# EAGLE design watch_main_final (EAGLE 6.6.0)
MY_DRAWING_NAME: Numitron Geekwatch Processor Board
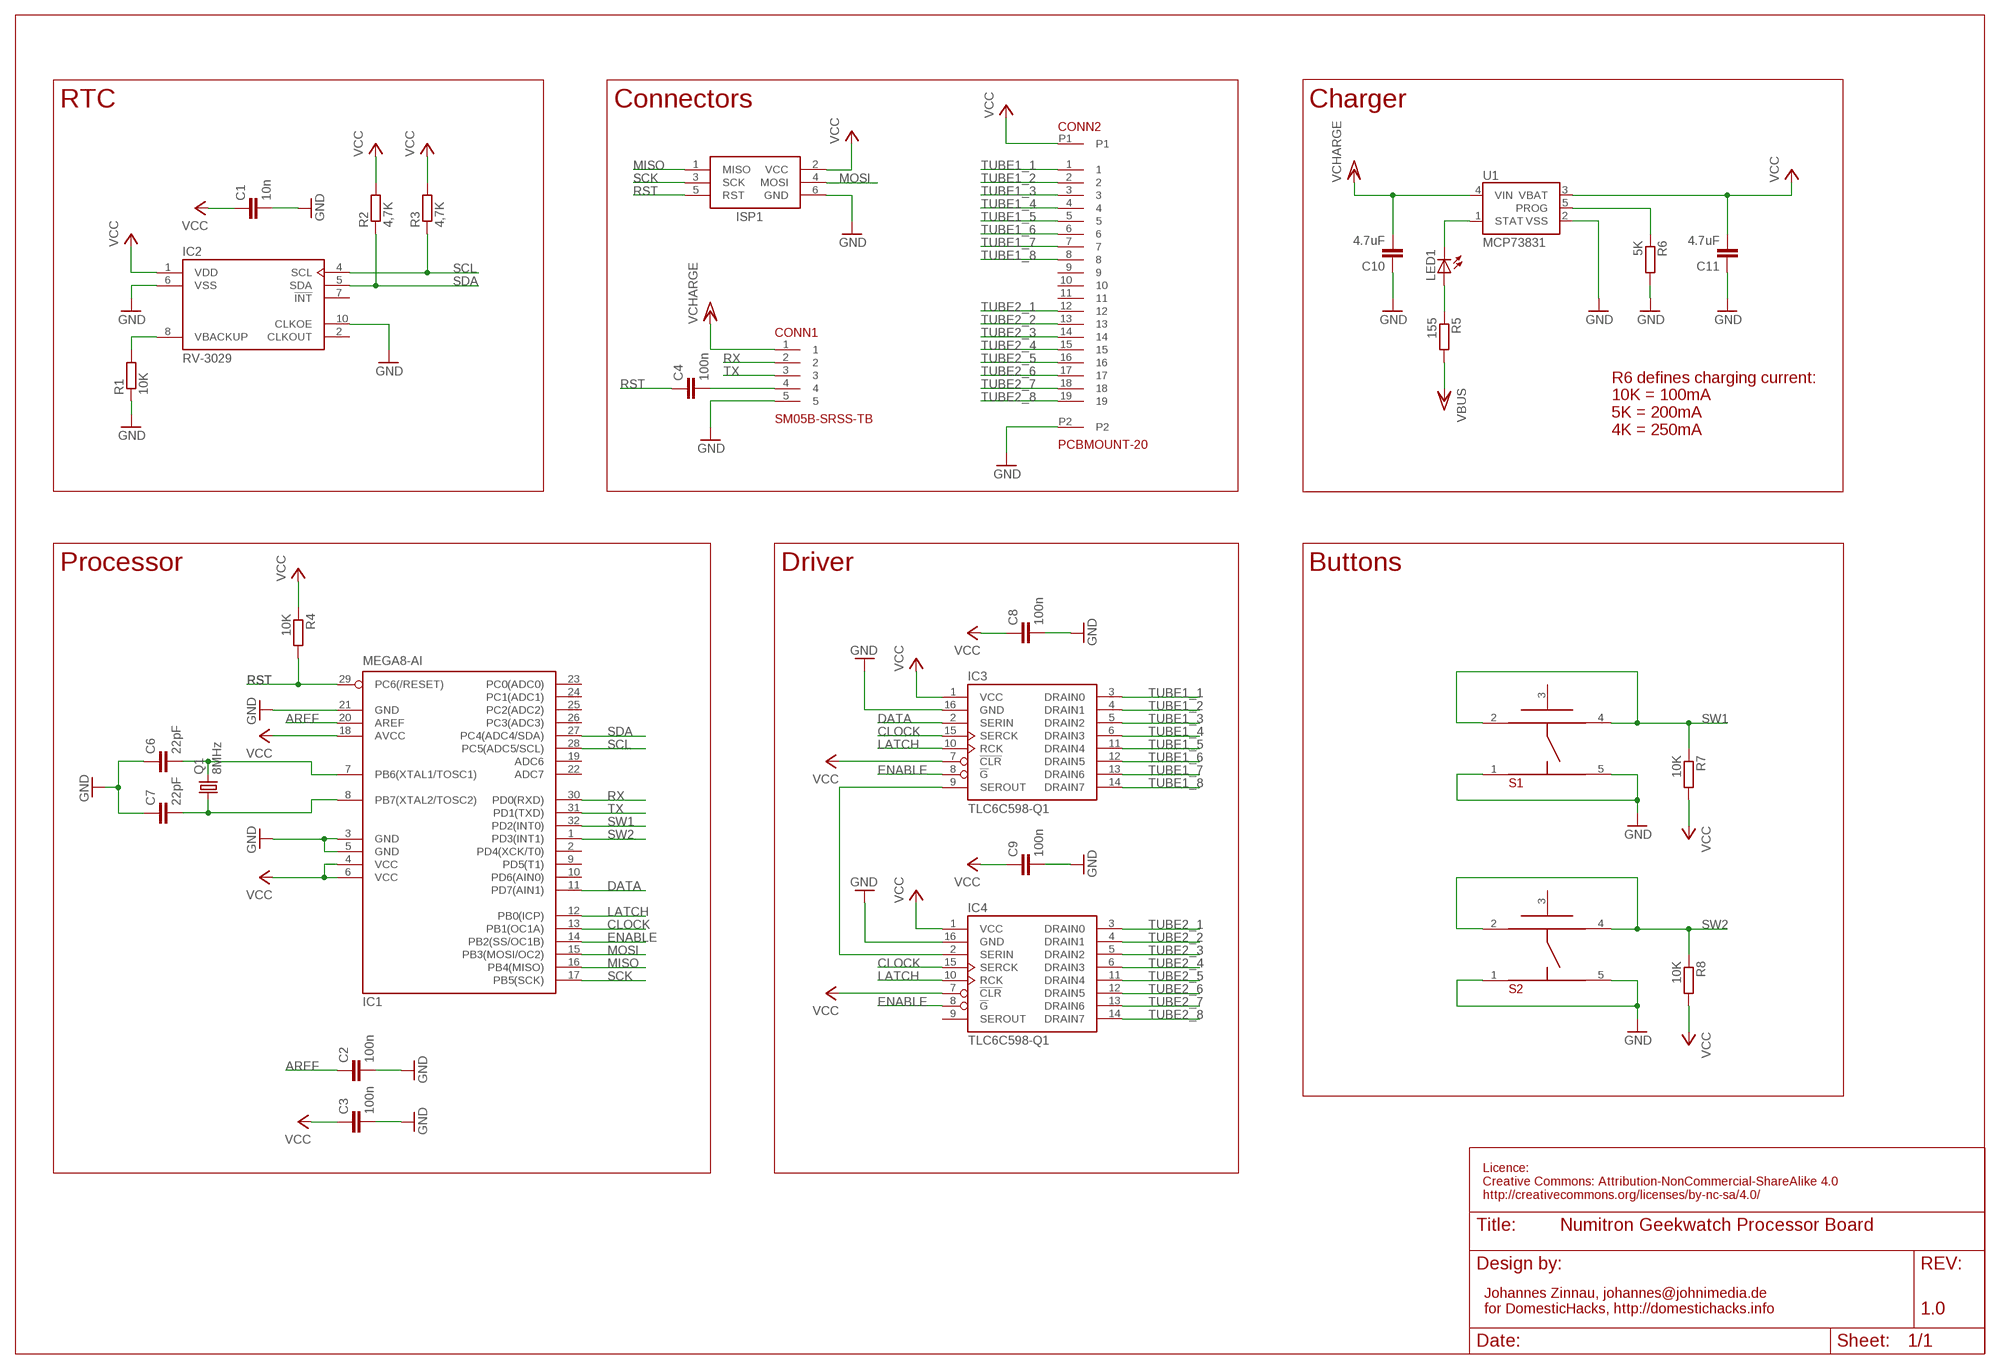
[diagram p0: schematic, sheet 1]

## Parts
C1  10n  C-EUC0603  [C0603]
C2  100n  C-EUC0603  [C0603]
C3  100n  C-EUC0603  [C0603]
C4  100n  C-EUC0603  [C0603]
C6  22pF  C-EUC0603  [C0603]
C7  22pF  C-EUC0603  [C0603]
C8  100n  C-EUC0603  [C0603]
C9  100n  C-EUC0603  [C0603]
C10  4.7uF  C-EUC0603  [C0603]
C11  4.7uF  C-EUC0603  [C0603]
CONN1  SM05B-SRSS-TB  [JST-SR-SIDE-5]
CONN2  PCBMOUNT-20  [PCBMOUNT-VERTICAL-20]
IC1  MEGA8-AI  [TQFP32-08]
IC2  RV-3029  [RV-3029-C2]
IC3  TLC6C598-Q1  [TSSOP-16]
IC4  TLC6C598-Q1  [TSSOP-16]
ISP1  AVRISP-6  [AVRISP]
LED1  HSMA/C/L-C120FLIPPED  [LED-0603-SIDE-FLIPPED]
Q1  8MHz  CRYSTALMQ  [MQ]
R1  10K  R-EU_R0603  [R0603]
R2  4,7K  R-EU_R0603  [R0603]
R3  4,7K  R-EU_R0603  [R0603]
R4  10K  R-EU_R0603  [R0603]
R5  155  R-EU_R0603  [R0603]
R6  5K  R-EU_R0603  [R0603]
R7  10K  R-EU_R0603  [R0603]
R8  10K  R-EU_R0603  [R0603]
S1  KMSXXXG  [C&K-KMS-SWITCH]
S2  KMSXXXG  [C&K-KMS-SWITCH]
U1  MCP73831  [SOT23-5]

## Nets
AREF: C2.1 IC1.20(AREF)
CLOCK: IC1.13(PB1(OC1A)) IC3.15(SERCK) IC4.15(SERCK)
DATA: IC1.11(PD7(AIN1)) IC3.2(SERIN)
ENABLE: IC1.14(PB2(SS/OC1B)) IC3.8(!G) IC4.8(!G)
GND: C1.2 C2.2 C3.2 C6.1 C7.1 C8.2 C9.2 C10.1 C11.1 CONN1.5 CONN2.P2 IC1.3(GND) IC1.5(GND) IC1.21(GND) IC2.6(VSS) IC2.10(CLKOE) IC3.16(GND) IC4.16(GND) ISP1.6(GND) R1.1 R6.2 S1.1 S1.5 S2.1 S2.5 U1.2(VSS)
LATCH: IC1.12(PB0(ICP)) IC3.10(RCK) IC4.10(RCK)
MISO: IC1.16(PB4(MISO)) ISP1.1(MISO)
MOSI: IC1.15(PB3(MOSI/OC2)) ISP1.4(MOSI)
N$1: IC2.8(VBACKUP) R1.2
N$2: IC3.9(SEROUT) IC4.2(SERIN)
N$3: C6.2 IC1.7(PB6(XTAL1/TOSC1)) Q1.P3
N$4: C7.2 IC1.8(PB7(XTAL2/TOSC2)) Q1.P1
N$5: LED1.C U1.1(STAT)
N$6: LED1.A R5.1
N$7: R6.1 U1.5(PROG)
N$11: C4.2 CONN1.4
RST: C4.1 IC1.29(PC6(/RESET)) ISP1.5(RST) R4.2
RX: CONN1.2 IC1.30(PD0(RXD))
SCK: IC1.17(PB5(SCK)) ISP1.3(SCK)
SCL: IC1.28(PC5(ADC5/SCL)) IC2.4(SCL) R3.1
SDA: IC1.27(PC4(ADC4/SDA)) IC2.5(SDA) R2.1
SW1: IC1.32(PD2(INT0)) R7.1 S1.2 S1.4
SW2: IC1.1(PD3(INT1)) R8.1 S2.2 S2.4
TUBE1_1: CONN2.1 IC3.3(DRAIN0)
TUBE1_2: CONN2.2 IC3.4(DRAIN1)
TUBE1_3: CONN2.3 IC3.5(DRAIN2)
TUBE1_4: CONN2.4 IC3.6(DRAIN3)
TUBE1_5: CONN2.5 IC3.11(DRAIN4)
TUBE1_6: CONN2.6 IC3.12(DRAIN5)
TUBE1_7: CONN2.7 IC3.13(DRAIN6)
TUBE1_8: CONN2.8 IC3.14(DRAIN7)
TUBE2_1: CONN2.12 IC4.3(DRAIN0)
TUBE2_2: CONN2.13 IC4.4(DRAIN1)
TUBE2_3: CONN2.14 IC4.5(DRAIN2)
TUBE2_4: CONN2.15 IC4.6(DRAIN3)
TUBE2_5: CONN2.16 IC4.11(DRAIN4)
TUBE2_6: CONN2.17 IC4.12(DRAIN5)
TUBE2_7: CONN2.18 IC4.13(DRAIN6)
TUBE2_8: CONN2.19 IC4.14(DRAIN7)
TX: CONN1.3 IC1.31(PD1(TXD))
VCC: C1.1 C3.1 C8.1 C9.1 C11.2 CONN2.P1 IC1.4(VCC) IC1.6(VCC) IC1.18(AVCC) IC2.1(VDD) IC3.1(VCC) IC3.7(!CLR) IC4.1(VCC) IC4.7(!CLR) ISP1.2(VCC) R2.2 R3.2 R4.1 R7.2 R8.2 U1.3(VBAT)
VCC/2: C10.2 CONN1.1 R5.2 U1.4(VIN) ; supply symbol labelled VCHARGE, VBUS
Unconnected: CONN2.9 CONN2.10 CONN2.11 IC1.2(PD4(XCK/T0)) IC1.9(PD5(T1)) IC1.10(PD6(AIN0)) IC1.19(ADC6) IC1.22(ADC7) IC1.23(PC0(ADC0)) IC1.24(PC1(ADC1)) IC1.25(PC2(ADC2)) IC1.26(PC3(ADC3)) IC2.2(CLKOUT) IC2.7(!INT) IC4.9(SEROUT) Q1.P2(GND) Q1.P4(GND1) S1.3 S2.3

## Notes on the sheet
- RTC | Connectors | Charger
- R6 defines charging current:
  10K = 100mA
  5K = 200mA
  4K = 250mA
- Processor | Driver | Buttons
- Licence: 
  Creative Commons: Attribution-NonCommercial-ShareAlike 4.0
  http://creativecommons.org/licenses/by-nc-sa/4.0/
- Johannes Zinnau, johannes@johnimedia.de 
  for DomesticHacks, http://domestichacks.info
- 1.0

## Library data of the parts
C1 C4 C8-C11 = resistor:C-EU: CAPACITOR, European symbol
C2 C3 C6 C7 = rcl:C-EU: CAPACITOR, European symbol
CONN1 = domestichacks:SM05B-SRSS-TB: SR / SZ CONNECTOR 1.0mm pitch/Disconnectable Insulation displacement connectors Shrouded header (SMT type)
CONN2 = domestichacks:PCBMOUNT-20
IC1 = atmel:MEGA8: MICROCONTROLLER 8 Kbytes FLASH, 1 kbytes SRAM, 512 bytes EEPROM, USART, 6-channel 10 bit ADC, 2-channel 8 bit ADC Pin compatible with Atmega48, ATMega88, ATMega168 Source: avr.lbr; MPN: ATMEGA8-16AU; OC_FARNELL: 9171371; OC_NEWARK: 73M8863
IC2 = domestichacks:RV-3029
IC3 IC4 = domestichacks:TLC6C598-Q1
ISP1 = adafruit:AVRISP: AVR ISP HEADER Standard 6 pin header for AVR programming
LED1 = domestichacks:HSMA/C/L-C120: Agilent HSMA/C/L-C120 Right Angle ChipLED HSMD/G/S/H-C120 HSMM/N/Q/R-C
Q1 = Crystals-new:CRYSTAL
R1-R8 = rcl:R-EU_: RESISTOR, European symbol
S1 S2 = domestichacks:KMSXXXG: C&K KMS Series Microminiature SMT Side Actuated KMS221G KMS223G KMS231G KMS233G
U1 = SparkFun-PowerIC:MCP73831: Miniature single cell, fully integrated Li-Ion, Li-polymer charge management controller http://ww1.microchip.com/downloads/en/DeviceDoc/21984a.pdf IC-09995; PROD_ID: IC-09995

## Board
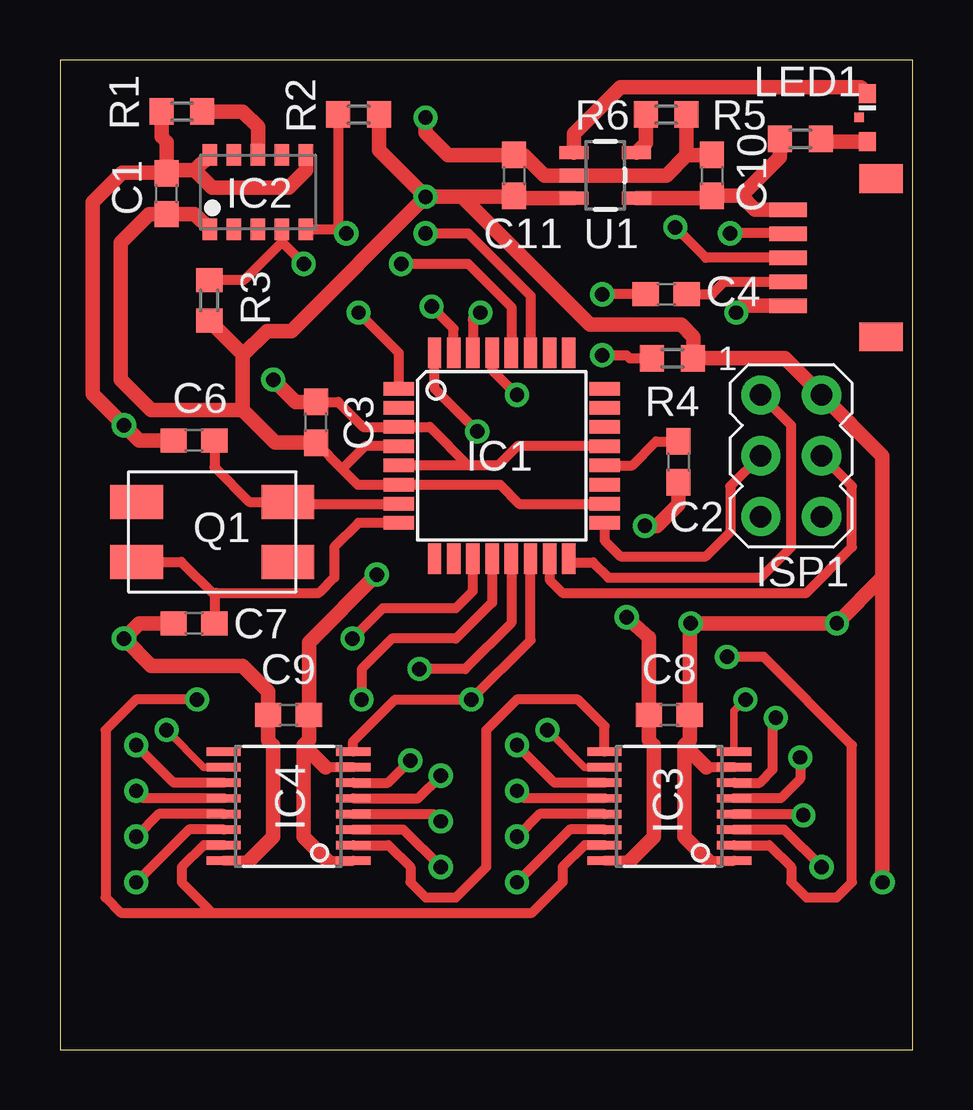
[diagram p1: board, top side]
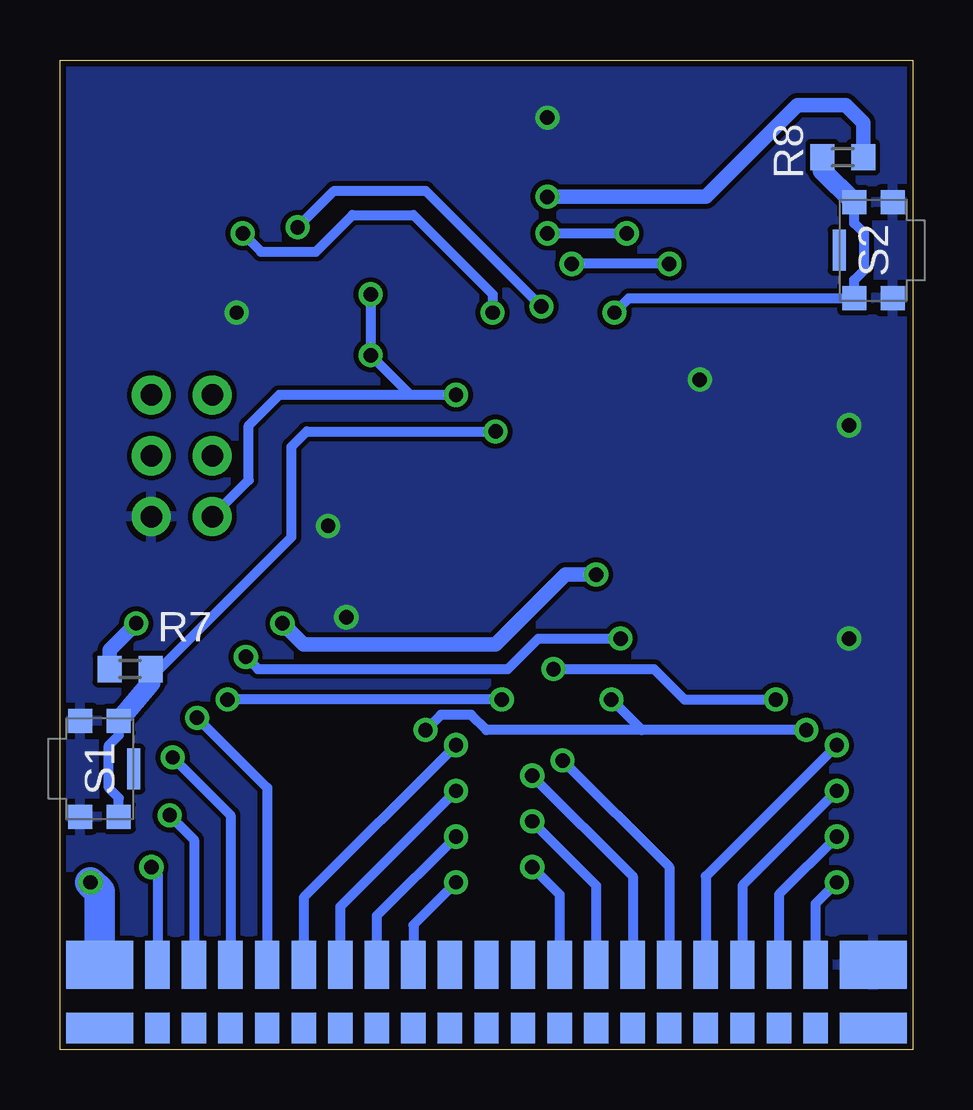
[diagram p2: board, bottom side, seen from below]

Size 35.56 x 41.27 mm. Coordinates in mm from the lower left corner, seen from the top.
Outline: 0,0 35.56,0 35.56,41.27 0,41.27 0,0
Copper layers (1*16): Top 0.035mm / dielectric 1.5mm / Bottom 0.035mm
Design rules "proto_tight": minimum track width 6mil, minimum drill 12mil, track to track 8mil, track to pad 8mil, pad to pad 8mil, via to via 8mil, smd to smd 6mil, copper to edge 10mil, drill to drill 8mil, minimum pad ring 10mil, minimum via ring 8mil, stop-mask expansion 4mil, vias tented up to drill 25mil, thermal gap 10mil

### Footprints (pad centres in the part's own frame; a part is rotated, then mirrored left to right if it is on the bottom)
C0603 = smd 1.1 x 1: 1 -0.85,0; 2 0.85,0
JST-SR-SIDE-5 = smd 0.6 x 1.55: 1 2,0; 2 1,0; 3 0,0; 4 -1,0; 5 -2,0 | smd 1.2 x 1.8: MNT1 3.3,-3.875; MNT2 -3.3,-3.875
PCBMOUNT-VERTICAL-20 = smd 1.016 x 2: 1 4.064,1; 2 5.588,1; 3 7.112,1; 4 8.636,1; 5 10.16,1; 6 11.684,1; 7 13.208,1; 8 14.732,1; 9 16.256,1; 10 17.78,1; 11 19.304,1; 12 20.828,1; 13 22.352,1; 14 23.876,1; 15 25.4,1; 16 26.924,1; 17 28.448,1; 18 29.972,1; 19 31.496,1 | smd 1.016 x 1.27: 20 4.064,-1.635; 21 5.588,-1.635; 22 7.112,-1.635; 23 8.636,-1.635; 24 10.16,-1.635; 25 11.684,-1.635; 26 13.208,-1.635; 27 14.732,-1.635; 28 16.256,-1.635; 29 17.78,-1.635; 30 19.304,-1.635; 31 20.828,-1.635; 32 22.352,-1.635; 33 23.876,-1.635; 34 25.4,-1.635; 35 26.924,-1.635; 36 28.448,-1.635; 37 29.972,-1.635; 38 31.496,-1.635 | smd 2.794 x 2: P1 1.651,1; P2 33.909,1 | smd 2.794 x 1.27: P3 33.909,-1.635; P4 1.651,-1.635
TQFP32-08 = smd 1.27 x 0.559: 1 -4.293,2.8; 2 -4.293,2; 3 -4.293,1.2; 4 -4.293,0.4; 5 -4.293,-0.4; 6 -4.293,-1.2; 7 -4.293,-2; 8 -4.293,-2.8; 17 4.293,-2.8; 18 4.293,-2; 19 4.293,-1.2; 20 4.293,-0.4; 21 4.293,0.4; 22 4.293,1.2; 23 4.293,2; 24 4.293,2.8 | smd 0.559 x 1.27: 9 -2.8,-4.293; 10 -2,-4.293; 11 -1.2,-4.293; 12 -0.4,-4.293; 13 0.4,-4.293; 14 1.2,-4.293; 15 2,-4.293; 16 2.8,-4.293; 25 2.8,4.293; 26 2,4.293; 27 1.2,4.293; 28 0.4,4.293; 29 -0.4,4.293; 30 -1.2,4.293; 31 -2,4.293; 32 -2.8,4.293
RV-3029-C2 = smd 0.6 x 0.9: 1 -2,-1.1; 2 -1,-1.1; 3 0,-1.1; 4 1,-1.1; 5 2,-1.1; 6 2,2; 7 1,2; 8 0,2; 9 -1,2; 10 -2,2
TSSOP-16 = smd 0.35 x 1.43: 1 -2.275,-2.7; 2 -1.625,-2.7; 3 -0.975,-2.7; 4 -0.325,-2.7; 5 0.325,-2.7; 6 0.975,-2.7; 7 1.625,-2.7; 8 2.275,-2.7; 9 2.275,2.7; 10 1.625,2.7; 11 0.975,2.7; 12 0.325,2.7; 13 -0.325,2.7; 14 -0.975,2.7; 15 -1.625,2.7; 16 -2.275,2.7
AVRISP = drill 0.9 pad 1.626: 1 -1.27,2.54; 2 1.27,2.54; 3 -1.27,0; 4 1.27,0; 5 -1.27,-2.54; 6 1.27,-2.54
LED-0603-SIDE-FLIPPED = smd 0.8 x 0.7: A -1,0; C 1,0 | smd 0.4 x 0.4: NC 0,0.35
MQ = smd 2.2 x 1.4: P1 -3.15,-1.25; P2 3.15,-1.25; P3 3.15,1.25; P4 -3.15,1.25
R0603 = smd 1 x 1.1: 1 -0.85,0; 2 0.85,0
C&K-KMS-SWITCH = smd 1 x 1: 1 -2,-0.8; 2 -2,0.8; 4 2,0.8; 5 2,-0.8 | smd 1.7 x 0.55: 3 0,1.425
SOT23-5 = smd 0.55 x 1.2: 1 -0.95,-1.3; 2 0,-1.3; 3 0.95,-1.3; 4 0.95,1.3; 5 -0.95,1.3

### Placement (x,y rotation side)
C1  4.45,35.69 90 top
C2  25.78,24.51 270 top
C3  10.67,26.16 90 top
C4  25.27,31.5 0 top
C6  5.59,25.4 0 top
C7  5.59,17.78 0 top
C8  25.4,13.97 180 top
C9  9.53,13.97 180 top
C10  27.18,36.45 270 top
C11  18.92,36.45 270 top
CONN1  30.35,33.02 90 top
CONN2  35.56,2.54 0 bottom
IC1  18.41,24.77 0 top
IC2  8.26,35.31 0 top
IC3  25.4,10.16 90 top
IC4  9.53,10.16 90 top
ISP1  30.48,24.77 0 top
LED1  33.66,38.86 90 top
Q1  6.35,21.59 0 top
R1  5.08,39.12 0 top
R2  12.45,38.99 0 top
R3  6.22,31.24 270 top
R4  25.53,28.83 180 top
R5  30.86,37.97 180 top
R6  25.27,38.99 0 top
R7  32.64,15.88 180 bottom
R8  2.92,37.21 0 bottom
S1  33.91,11.72 270 bottom
S2  1.65,33.34 90 bottom
U1  22.73,36.45 270 top

### Tracks (layer width: path | path; a pad name or v marks a point on that pad's centre or on a via)
AREF
  Top 0.406: IC1.20 23.86,24.36 24.85,25.36 C2.1
CLOCK  (via drill 0.6)
  Top 0.406: IC4.15 6,8.54 5.08,7.62 5.08,6.99 6.35,5.71 | 6.35,5.71 19.68,5.71 20.95,6.99 20.95,7.62 21.87,8.54 IC3.15 | IC1.13 18.82,17.8 16.89,15.88 v14.99,15.88 | 6.35,5.71 2.54,5.71 1.91,6.35 1.91,13.34 3.17,14.61 v5.71,14.61
  Bottom 0.406: v14.99,15.88 10.79,15.88 9.53,14.61 v5.71,14.61
DATA  (via drill 0.6)
  Top 0.305: 17.14,20.4 IC1.11
  Top 0.406: IC3.2 29.57,8.54 30.48,7.62 30.48,6.99 31.11,6.35 32.38,6.35 33.02,6.99 33.02,12.7 29.34,16.38 v27.81,16.38 | v12.19,17.14 13.46,18.41 16.51,18.41 17.21,19.12 IC1.11
  Bottom 0.406: v12.19,17.14 15.62,17.14 16.89,15.88 27.3,15.88 v27.81,16.38
ENABLE  (via drill 0.6)
  Top 0.305: IC3.8 28.1,14.13 v28.57,14.61
  Top 0.406: IC1.14 19.61,17.07 v17.14,14.61 13.97,14.61 12.22,12.86 IC4.8
  Bottom 0.406: v17.14,14.61 v28.57,14.61
GND  (via drill 0.6)
  Top 0.406: 7.88,7.88 IC4.16 | 23.76,7.88 IC3.16 | C1.2 4.48,36.58 | 4.58,36.67 C1.2 | 4.41,36.58 C1.2 | IC1.21 19.07,25.16 18.27,24.36 17.02,24.36 | 17.02,24.36 15.42,25.96 IC1.3 12.64,25.96 11.6,27.01 C3.2 | 17.02,24.36 IC1.5 | 28.48,31.02 v28.19,30.73
  Top 0.61: 7.88,7.88 8.89,8.89 8.89,12.7 8.68,12.91 C9.2 8.68,14.95 7.62,16 3.81,16 v2.67,17.14 3.3,17.78 C7.1 | 23.76,7.88 24.77,8.89 24.77,12.7 24.55,12.91 C8.2 24.55,17.18 v23.62,18.03 | 26.12,37.3 25.27,36.45 U1.2 20.19,36.45 19.34,37.3 C11.1 16.17,37.3 15.24,38.23 v15.24,38.86 | 26.12,37.3 C10.1 | R6.2 26.12,37.3 | IC2.10 5.62,36.67 | IC2.6 10.26,36.67 9.53,35.94 6.35,35.94 5.62,36.67 | 5.62,36.67 4.58,36.67 | R1.1 4.23,38.06 4.45,37.85 C1.2 | C6.1 3.3,25.4 v2.67,26.04 1.36,27.34 1.36,35.34 2.6,36.58 4.41,36.58 | C2.2 25.78,22.73 24.89,21.84 v24.38,21.84 | v8.89,27.94 9.82,27.01 C3.2 | CONN1.5 28.48,31.02
  pour Bottom: 0,41.27 35.56,41.27 35.56,0 0,0
LATCH  (via drill 0.6)
  Top 0.305: IC4.10 6,11.79 v4.45,13.34 | v20.32,13.34 21.87,11.79 IC3.10
  Top 0.406: IC1.12 18.02,18.65 16.51,17.14 13.84,17.14 12.57,15.88 v12.57,14.61
  Bottom 0.406: v4.45,13.34 11.3,13.34 | 11.3,13.34 17.78,13.34 18.41,13.97 19.68,13.97 v20.32,13.34 | v12.57,14.61 11.3,13.34
MISO
  Top 0.305: IC1.16 21.37,20.32
  Top 0.406: ISP1.1 30.48,26.04 30.48,20.95 29.21,19.68 22.86,19.68 22.23,20.32 21.37,20.32
MOSI
  Top 0.406: IC1.15 20.41,19.59 20.95,19.05 31.11,19.05 33.02,20.95 33.02,23.49 ISP1.4
N$1
  Top 0.61: R1.2 7.62,39.12 8.26,38.48 IC2.8
N$2
  Top 0.406: IC4.2 13.69,8.54 14.61,7.62 14.61,6.99 15.24,6.35 16.51,6.35 17.78,7.62 17.78,13.34 19.05,14.61 21.59,14.61 22.7,13.5 IC3.9
N$3
  Top 0.406: IC1.7 10.26,22.77 10.18,22.84 Q1.P3 7.89,22.84 6.44,24.3 C6.2
N$4
  Top 0.406: 13.71,21.96 IC1.8 12.44,21.96 11.43,20.95 11.43,19.68 10.79,19.05 6.53,19.05 6.44,18.96 | Q1.P1 5.06,20.34 6.44,18.96 | 6.44,18.96 C7.2
N$5
  Top 0.61: U1.1 21.43,38.2 23.37,40.13 33.38,40.13 LED1.C
N$6
  Top 0.61: R5.1 31.82,37.86 LED1.A
N$7
  Top 0.61: R6.1 24.42,37.79 U1.5
N$11
  Top 0.406: C4.2 27.18,31.5 27.7,32.02 CONN1.4
RST  (via drill 0.6)
  Top 0.406: IC1.29 18.02,28.34 v19.05,27.3 | v22.61,28.96 23.62,28.96 23.75,28.83 R4.2 | C4.1 v22.61,31.5
  Bottom 0.406: ISP1.5 27.69,23.75 27.69,26.04 26.42,27.3 20.95,27.3 | v19.05,27.3 20.95,27.3 | 20.95,27.3 v22.61,28.96 v22.61,31.5
RX  (via drill 0.6)
  Top 0.406: CONN1.2 30.34,34.04 v27.94,34.04 | v17.53,30.73 arc90 17.21,30.42 IC1.30
  Bottom 0.406: v27.94,34.04 27.18,33.27 24.89,33.27 23.37,34.8 20.83,34.8 17.53,31.5 v17.53,30.73
SCK
  Top 0.406: ISP1.3 27.94,23.49 27.94,21.59 26.92,20.57 23.37,20.57 22.71,21.23 IC1.17
SCL  (via drill 0.6)
  Top 0.406: IC2.4 9.26,33.67 | 9.26,33.67 v10.16,32.77 | 9.26,33.67 7.68,32.09 R3.1 | v14.22,32.77 17.02,32.77 18.82,30.97 IC1.28
  Bottom 0.406: v10.16,32.77 v14.22,32.77
SDA  (via drill 0.6)
  Top 0.406: IC2.5 11.77,34.21 v11.94,34.04 arc-90 11.6,34.38 R2.1 | v15.24,34.04 17.02,34.04 19.61,31.44 IC1.27
  Bottom 0.406: v15.24,34.04 v11.94,34.04
SW1  (via drill 0.6)
  Top 0.406: v17.4,25.78 15.62,27.56 IC1.32
  Bottom 0.406: v17.4,25.78 25.27,25.78 25.91,25.15 25.91,21.38 31.41,15.88 R7.1 31.79,16 | S1.4 33.11,10.5 33.53,10.92 33.53,12.7 33.11,13.12 S1.2
  Bottom 0.813: R7.1 31.79,15.29 S1.2
SW2  (via drill 0.6)
  Top 0.406: v12.45,30.73 14.12,29.06 IC1.1
  Bottom 0.406: S2.4 2.45,34.45 2.03,34.04 2.03,32.51 2.45,32.09 S2.2 11.84,31.34 v12.45,30.73
  Bottom 0.813: S2.4 3.77,36.66 R8.1
TUBE1_1  (via drill 0.6)
  Top 0.406: IC3.3 30.18,9.18 v31.75,7.62
  Bottom 0.406: v31.75,7.62 31.5,7.37 CONN2.1
TUBE1_2  (via drill 0.6)
  Top 0.406: IC3.4 30.99,9.84 v30.99,9.78
  Bottom 0.406: CONN2.2 29.97,8.76 v30.99,9.78
TUBE1_3  (via drill 0.6)
  Top 0.406: v30.86,12.19 30.86,11.3 30.04,10.48 IC3.5
  Bottom 0.406: CONN2.3 28.45,9.78 v30.86,12.19
TUBE1_4  (via drill 0.6)
  Top 0.406: IC3.6 29.17,11.14 29.72,11.68 29.72,13.72 v29.84,13.84
  Bottom 0.406: CONN2.4 26.92,10.92 v29.84,13.84
TUBE1_5  (via drill 0.6)
  Top 0.406: IC3.11 20.61,11.14 v19.05,12.7
  Bottom 0.406: v19.05,12.7 25.4,6.35 CONN2.5
TUBE1_6  (via drill 0.6)
  Top 0.406: IC3.12 19.36,10.48 v19.05,10.8
  Bottom 0.406: v19.05,10.8 23.88,5.97 CONN2.6
TUBE1_7  (via drill 0.6)
  Top 0.406: IC3.13 20,9.84 v19.05,8.89
  Bottom 0.406: v19.05,8.89 22.35,5.59 CONN2.7
TUBE1_8  (via drill 0.6)
  Top 0.406: IC3.14 21.25,9.18 v19.05,6.99
  Bottom 0.406: v19.05,6.99 20.83,5.21 CONN2.8
TUBE2_1  (via drill 0.6)
  Top 0.406: IC4.3 14.31,9.18 v15.88,7.62
  Bottom 0.406: v15.88,7.62 14.73,6.48 CONN2.12
TUBE2_2  (via drill 0.6)
  Top 0.406: IC4.4 15.56,9.84 v15.88,9.53
  Bottom 0.406: v15.88,9.53 13.21,6.86 CONN2.13
TUBE2_3  (via drill 0.6)
  Top 0.406: IC4.5 14.93,10.48 v15.88,11.43
  Bottom 0.406: v15.88,11.43 11.68,7.24 CONN2.14
TUBE2_4  (via drill 0.6)
  Top 0.406: IC4.6 13.68,11.14 v14.61,12.07
  Bottom 0.406: v14.61,12.07 10.16,7.62 CONN2.15
TUBE2_5  (via drill 0.6)
  Top 0.406: IC4.11 4.74,11.14 v3.17,12.7
  Bottom 0.406: v3.17,12.7 8.64,7.24 CONN2.16
TUBE2_6  (via drill 0.6)
  Top 0.406: IC4.12 3.48,10.48 v3.17,10.8
  Bottom 0.406: v3.17,10.8 7.11,6.86 CONN2.17
TUBE2_7  (via drill 0.6)
  Top 0.406: IC4.13 4.12,9.84 v3.17,8.89
  Bottom 0.406: v3.17,8.89 5.59,6.48 CONN2.18
TUBE2_8  (via drill 0.6)
  Top 0.406: IC4.14 5.38,9.18 v3.17,6.99
  Bottom 0.406: v3.17,6.99 4.06,6.1 CONN2.19
TX  (via drill 0.6)
  Top 0.406: CONN1.3 26.92,33.02 v25.65,34.29 | IC1.31 16.41,30.07 v15.49,30.99
  Bottom 0.406: v25.65,34.29 24.13,35.81 20.32,35.81 v15.49,30.99
VCC  (via drill 0.6)
  Top 0.406: 11.16,7.88 IC4.1 | IC4.7 11.07,11.79 | 27.04,7.88 IC3.1 | IC3.7 26.95,11.79 | 19.02,35.5 C11.2 | IC1.18 19.14,22.77 18.34,23.56 IC1.6 12.41,23.56 11.77,24.21 | C3.1 11.77,24.21 | IC1.4 12.72,25.16 11.77,24.21 | IC2.1 6.35,34.21
  Top 0.61: 10.16,12.7 10.38,12.91 C9.1 10.38,16.98 v13.21,19.81 | 10.16,12.7 10.16,8.89 11.16,7.88 | 11.07,11.79 10.16,12.7 | 26.04,12.7 26.25,12.91 C8.1 26.25,17.74 v26.29,17.78 v32.38,17.78 34.29,19.68 | 26.04,12.7 26.04,8.89 27.04,7.88 | 26.95,11.79 26.04,12.7 | U1.3 19.02,35.5 | IC2.1 5.62,34.84 C1.1 3.72,34.84 2.54,33.66 2.54,27.94 3.81,26.67 7.62,26.67 | v34.29,6.99 34.29,19.68 | 34.29,19.68 34.29,24.77 ISP1.2 30.23,28.83 R4.1 26.42,28.87 26.42,29.72 25.91,30.23 22.1,30.23 16.76,35.56 | C3.1 8.98,25.31 7.62,26.67 | C11.2 18.84,35.69 18.71,35.56 16.76,35.56 | 7.62,26.67 7.62,28.96 | 7.62,28.96 8.64,29.97 9.65,29.97 v15.24,35.56 | 16.76,35.56 v15.24,35.56 | R2.2 13.3,37.5 v15.24,35.56 | R3.2 7.62,28.99 7.62,28.96
  Bottom 0.61: R7.2 33.49,16.68 v32.38,17.78 | v13.21,19.81 14.48,19.81 17.4,16.89 25.4,16.89 v26.29,17.78 | R8.2 2.07,38.65 2.79,39.37 4.83,39.37 8.64,35.56 v15.24,35.56
  Bottom 1.27: v34.29,6.99 33.91,6.6 CONN2.P1
VCC/2
  Top 0.61: 27.08,35.5 C10.2 | 28.4,35.6 C10.2 | CONN1.1 28.98,35.02 28.4,35.6 | U1.4 27.08,35.5 | 27.08,35.5 arc90 C10.2 | 28.4,35.6 30.01,37.21 R5.2